# Altium schematic sheet ADC-DMUX.SchDoc: <SPECIFIC SHEET FUNCTION>
size A3; Date: DO NOT USE, RATHER USE PROJ OPTIONS; DrawnBy: DO NOT USE, RATHER USE PROJ OPTIONS; Engineer: DO NOT USE, RATHER USE PROJ OPTIONS; Organization: DO NOT USE, RATHER USE PROJ OPTIONS; DocumentNumber: 2; Revision: DO NOT USE, RATHER USE PROJ OPTIONS; SheetNumber: 6; SheetTotal: 12; SCH_Sheet_Filename: ADC-DMUX.SchDoc; CurrentTime: DO NOT USE, RATHER USE PROJ OPTIONS; Time: DO NOT USE, RATHER USE PROJ OPTIONS; DocumentFullPathAndName: DO NOT USE, RATHER USE PROJ OPTIONS; DocumentName: DO NOT USE, RATHER USE PROJ OPTIONS; ModifiedDate: DO NOT USE, RATHER USE PROJ OPTIONS; ImagePath: DO NOT USE, RATHER USE PROJ OPTIONS
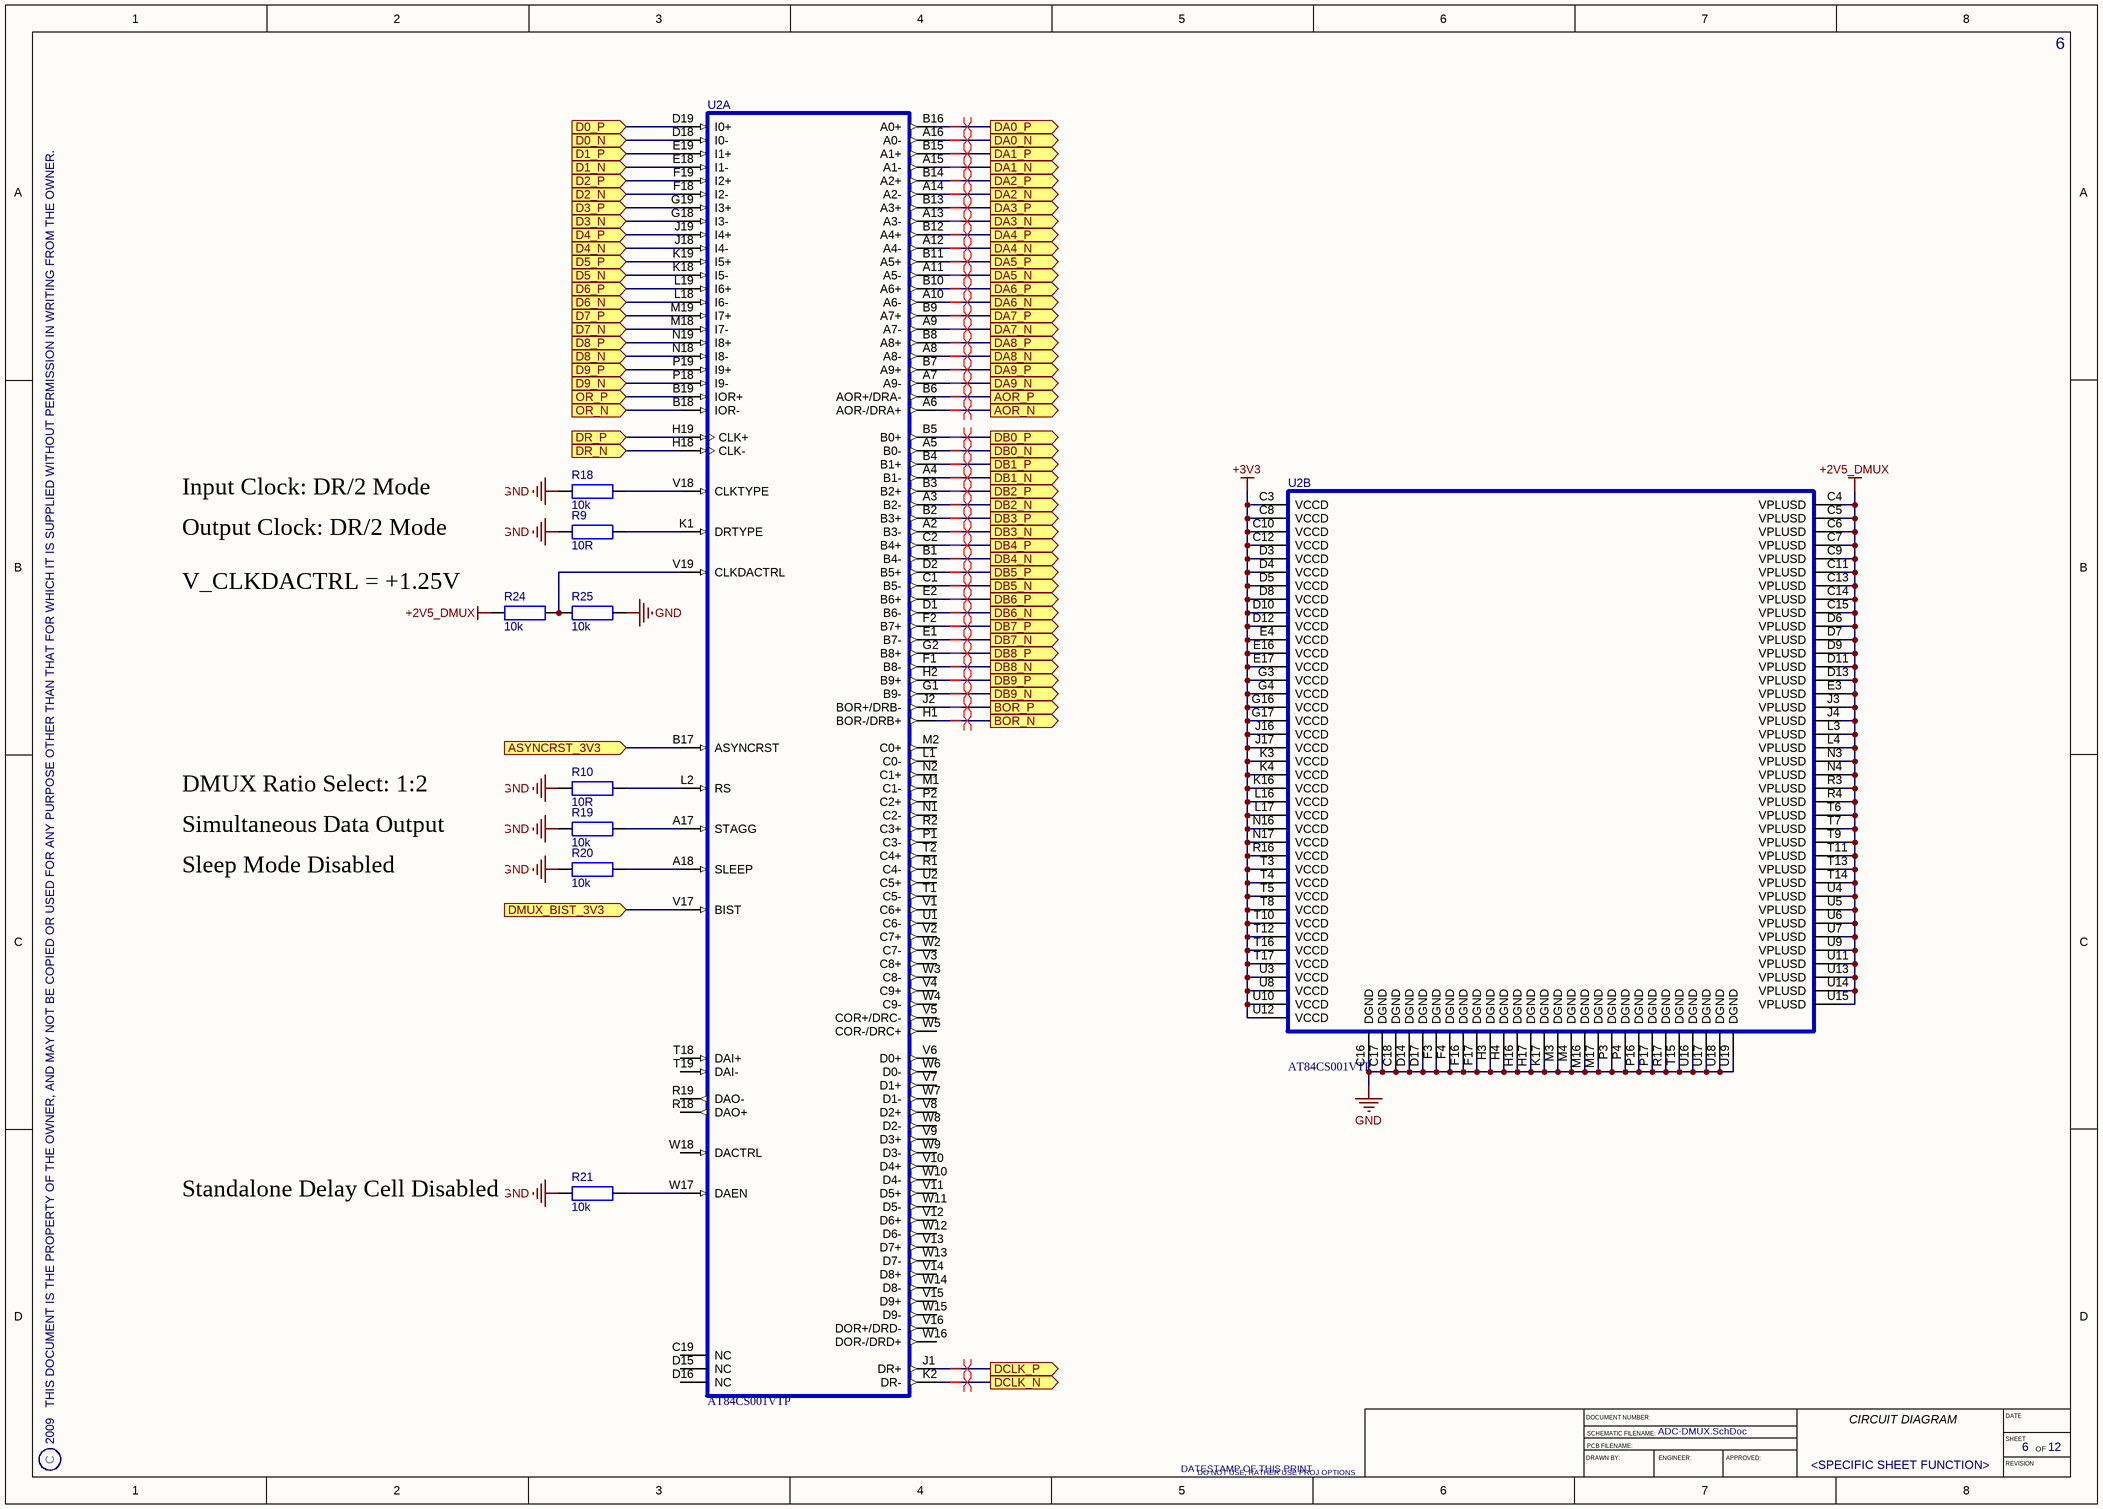
[diagram p0: ADC-DMUX.SchDoc]

## Parts
R9  10R  [0603]
R10  10R  [0603]
R18  10k  [0603]
R19  10k  [0603]
R20  10k  [0603]
R21  10k  [0603]
R24  10k  [0603]
R25  10k  [0603]
U2  AT84CS001VTP  [BGA240x19]  (parts A,B of 2)

## Ports
AOR_N (out), AOR_P (out), ASYNCRST_3V3 (in), BOR_N (out), BOR_P (out), D0_N (in), D0_P (in), D1_N (in), D1_P (in), D2_N (in), D2_P (in), D3_N (in), D3_P (in), D4_N (in), D4_P (in), D5_N (in), D5_P (in), D6_N (in), D6_P (in), D7_N (in), D7_P (in), D8_N (in), D8_P (in), D9_N (in), D9_P (in), DA0_N (out), DA0_P (out), DA1_N (out), DA1_P (out), DA2_N (out), DA2_P (out), DA3_N (out), DA3_P (out), DA4_N (out), DA4_P (out), DA5_N (out), DA5_P (out), DA6_N (out), DA6_P (out), DA7_N (out), DA7_P (out), DA8_N (out), DA8_P (out), DA9_N (out), DA9_P (out), DB0_N (out), DB0_P (out), DB1_N (out), DB1_P (out), DB2_N (out), DB2_P (out), DB3_N (out), DB3_P (out), DB4_N (out), DB4_P (out), DB5_N (out), DB5_P (out), DB6_N (out), DB6_P (out), DB7_N (out), DB7_P (out), DB8_N (out), DB8_P (out), DB9_N (out), DB9_P (out), DCLK_N (out), DCLK_P (out), DMUX_BIST_3V3 (in), DR_N (in), DR_P (in), OR_N (in), OR_P (in)

## Nets
+2V5_DMUX: R24.1 U2.C4(VPLUSD) U2.C5(VPLUSD) U2.C6(VPLUSD) U2.C7(VPLUSD) U2.C9(VPLUSD) U2.C11(VPLUSD) U2.C13(VPLUSD) U2.C14(VPLUSD) U2.C15(VPLUSD) U2.D6(VPLUSD) U2.D7(VPLUSD) U2.D9(VPLUSD) U2.D11(VPLUSD) U2.D13(VPLUSD) U2.E3(VPLUSD) U2.J3(VPLUSD) U2.J4(VPLUSD) U2.L3(VPLUSD) U2.L4(VPLUSD) U2.N3(VPLUSD) U2.N4(VPLUSD) U2.R3(VPLUSD) U2.R4(VPLUSD) U2.T6(VPLUSD) U2.T7(VPLUSD) U2.T9(VPLUSD) U2.T11(VPLUSD) U2.T13(VPLUSD) U2.T14(VPLUSD) U2.U4(VPLUSD) U2.U5(VPLUSD) U2.U6(VPLUSD) U2.U7(VPLUSD) U2.U9(VPLUSD) U2.U11(VPLUSD) U2.U13(VPLUSD) U2.U14(VPLUSD) U2.U15(VPLUSD)
+3V3: U2.C3(VCCD) U2.C8(VCCD) U2.C10(VCCD) U2.C12(VCCD) U2.D3(VCCD) U2.D4(VCCD) U2.D5(VCCD) U2.D8(VCCD) U2.D10(VCCD) U2.D12(VCCD) U2.E4(VCCD) U2.E16(VCCD) U2.E17(VCCD) U2.G3(VCCD) U2.G4(VCCD) U2.G16(VCCD) U2.G17(VCCD) U2.J16(VCCD) U2.J17(VCCD) U2.K3(VCCD) U2.K4(VCCD) U2.K16(VCCD) U2.L16(VCCD) U2.L17(VCCD) U2.N16(VCCD) U2.N17(VCCD) U2.R16(VCCD) U2.T3(VCCD) U2.T4(VCCD) U2.T5(VCCD) U2.T8(VCCD) U2.T10(VCCD) U2.T12(VCCD) U2.T16(VCCD) U2.T17(VCCD) U2.U3(VCCD) U2.U8(VCCD) U2.U10(VCCD) U2.U12(VCCD)
GND: R9.1 R10.1 R18.1 R19.1 R20.1 R21.1 R25.2 U2.C16(DGND) U2.C17(DGND) U2.C18(DGND) U2.D14(DGND) U2.D17(DGND) U2.F3(DGND) U2.F4(DGND) U2.F16(DGND) U2.F17(DGND) U2.H3(DGND) U2.H4(DGND) U2.H16(DGND) U2.H17(DGND) U2.K17(DGND) U2.M3(DGND) U2.M4(DGND) U2.M16(DGND) U2.M17(DGND) U2.P3(DGND) U2.P4(DGND) U2.P16(DGND) U2.P17(DGND) U2.R17(DGND) U2.T15(DGND) U2.U16(DGND) U2.U17(DGND) U2.U18(DGND) U2.U19(DGND)
AOR_N: U2.A6(AOR-/DRA+) ; port AOR_N
AOR_P: U2.B6(AOR+/DRA-) ; port AOR_P
ASYNCRST_3V3: U2.B17(ASYNCRST) ; port ASYNCRST_3V3
BOR_N: U2.H1(BOR-/DRB+) ; port BOR_N
BOR_P: U2.J2(BOR+/DRB-) ; port BOR_P
D0_N: U2.D18(I0-) ; port D0_N
D0_P: U2.D19(I0+) ; port D0_P
D1_N: U2.E18(I1-) ; port D1_N
D1_P: U2.E19(I1+) ; port D1_P
D2_N: U2.F18(I2-) ; port D2_N
D2_P: U2.F19(I2+) ; port D2_P
D3_N: U2.G18(I3-) ; port D3_N
D3_P: U2.G19(I3+) ; port D3_P
D4_N: U2.J18(I4-) ; port D4_N
D4_P: U2.J19(I4+) ; port D4_P
D5_N: U2.K18(I5-) ; port D5_N
D5_P: U2.K19(I5+) ; port D5_P
D6_N: U2.L18(I6-) ; port D6_N
D6_P: U2.L19(I6+) ; port D6_P
D7_N: U2.M18(I7-) ; port D7_N
D7_P: U2.M19(I7+) ; port D7_P
D8_N: U2.N18(I8-) ; port D8_N
D8_P: U2.N19(I8+) ; port D8_P
D9_N: U2.P18(I9-) ; port D9_N
D9_P: U2.P19(I9+) ; port D9_P
DA0_N: U2.A16(A0-) ; port DA0_N
DA0_P: U2.B16(A0+) ; port DA0_P
DA1_N: U2.A15(A1-) ; port DA1_N
DA1_P: U2.B15(A1+) ; port DA1_P
DA2_N: U2.A14(A2-) ; port DA2_N
DA2_P: U2.B14(A2+) ; port DA2_P
DA3_N: U2.A13(A3-) ; port DA3_N
DA3_P: U2.B13(A3+) ; port DA3_P
DA4_N: U2.A12(A4-) ; port DA4_N
DA4_P: U2.B12(A4+) ; port DA4_P
DA5_N: U2.A11(A5-) ; port DA5_N
DA5_P: U2.B11(A5+) ; port DA5_P
DA6_N: U2.A10(A6-) ; port DA6_N
DA6_P: U2.B10(A6+) ; port DA6_P
DA7_N: U2.A9(A7-) ; port DA7_N
DA7_P: U2.B9(A7+) ; port DA7_P
DA8_N: U2.A8(A8-) ; port DA8_N
DA8_P: U2.B8(A8+) ; port DA8_P
DA9_N: U2.A7(A9-) ; port DA9_N
DA9_P: U2.B7(A9+) ; port DA9_P
DB0_N: U2.A5(B0-) ; port DB0_N
DB0_P: U2.B5(B0+) ; port DB0_P
DB1_N: U2.A4(B1-) ; port DB1_N
DB1_P: U2.B4(B1+) ; port DB1_P
DB2_N: U2.A3(B2-) ; port DB2_N
DB2_P: U2.B3(B2+) ; port DB2_P
DB3_N: U2.A2(B3-) ; port DB3_N
DB3_P: U2.B2(B3+) ; port DB3_P
DB4_N: U2.B1(B4-) ; port DB4_N
DB4_P: U2.C2(B4+) ; port DB4_P
DB5_N: U2.C1(B5-) ; port DB5_N
DB5_P: U2.D2(B5+) ; port DB5_P
DB6_N: U2.D1(B6-) ; port DB6_N
DB6_P: U2.E2(B6+) ; port DB6_P
DB7_N: U2.E1(B7-) ; port DB7_N
DB7_P: U2.F2(B7+) ; port DB7_P
DB8_N: U2.F1(B8-) ; port DB8_N
DB8_P: U2.G2(B8+) ; port DB8_P
DB9_N: U2.G1(B9-) ; port DB9_N
DB9_P: U2.H2(B9+) ; port DB9_P
DCLK_N: U2.K2(DR-) ; port DCLK_N
DCLK_P: U2.J1(DR+) ; port DCLK_P
DMUX_BIST_3V3: U2.V17(BIST) ; port DMUX_BIST_3V3
DR_N: U2.H18(CLK-) ; port DR_N
DR_P: U2.H19(CLK+) ; port DR_P
OR_N: U2.B18(IOR-) ; port OR_N
OR_P: U2.B19(IOR+) ; port OR_P
NetR9_2: R9.2 U2.K1(DRTYPE)
NetR10_2: R10.2 U2.L2(RS)
NetR18_2: R18.2 U2.V18(CLKTYPE)
NetR19_2: R19.2 U2.A17(STAGG)
NetR20_2: R20.2 U2.A18(SLEEP)
NetR21_2: R21.2 U2.W17(DAEN)
NetR24_2: R24.2 R25.1 U2.V19(CLKDACTRL)

Not connected (* = marked no-connect by the designer): U2 C19(NC) D15(NC) D16(NC) L1(C0-) M1(C1-) M2(C0+) N1(C2-) N2(C1+) P1(C3-) P2(C2+) R1(C4-) R2(C3+) R18(DAO+) R19(DAO-) T1(C5-) T2(C4+) T18(DAI+) T19(DAI-) U1(C6-) U2(C5+) V1(C6+) V2(C7+) V3(C8+) V4(C9+) V5(COR+/DRC-) V6(D0+) V7(D1+) V8(D2+) V9(D3+) V10(D4+) V11(D5+) V12(D6+) V13(D7+) V14(D8+) V15(D9+) V16(DOR+/DRD-) W2(C7-) W3(C8-) W4(C9-) W5(COR-/DRC+) W6(D0-) W7(D1-) W8(D2-) W9(D3-) W10(D4-) W11(D5-) W12(D6-) W13(D7-) W14(D8-) W15(D9-) W16(DOR-/DRD+) W18(DACTRL)

## Layout directives
differential pair: AOR_N, AOR_P, BOR_N, BOR_P, DA0_N, DA0_P, DA1_N, DA1_P, DA2_N, DA2_P, DA3_N, DA3_P, DA4_N, DA4_P, DA5_N, DA5_P, DA6_N, DA6_P, DA7_N, DA7_P, DA8_N, DA8_P, DA9_N, DA9_P, DB0_N, DB0_P, DB1_N, DB1_P, DB2_N, DB2_P, DB3_N, DB3_P, DB4_N, DB4_P, DB5_N, DB5_P, DB6_N, DB6_P, DB7_N, DB7_P, DB8_N, DB8_P, DB9_N, DB9_P, DCLK_N, DCLK_P

## Notes on the sheet
- Input Clock: DR/2 Mode
- Output Clock: DR/2 Mode
- (near R24) V_CLKDACTRL = +1.25V
- Simultaneous Data Output
- DMUX Ratio Select: 1:2
- Sleep Mode Disabled
- Standalone Delay Cell Disabled
- 2009   THIS DOCUMENT IS THE PROPERTY OF THE OWNER, AND MAY NOT BE COPIED OR USED FOR ANY PURPOSE OTHER THAN THAT FOR WHICH IT IS SUPPLIED WITHOUT PERMISSION IN WRITING FROM THE OWNER.
- C
- DATESTAMP OF THIS PRINT
- DRAWN BY:
- DOCUMENT NUMBER:
- SCHEMATIC FILENAME:
- PCB FILENAME:
- ENGINEER:
- APPROVED:
- CIRCUIT DIAGRAM
- DATE
- SHEET
- REVISION
- OF

## Library data of the parts
R9 R10 R18-R21 R24 R25 = RES-0805: RESISTOR SMD 0603; Checked_By: NN; Manufacturer: *; Manufacturer_PN: *; Created_By: *; Checked_Date: 5-08-2009; HelpURL: *; ComponentLink1Description: Footprint Detail; ComponentLink1URL: *; ComponentLink2Description: Application Note; ComponentLink2URL: *; ComponentLink3Description: Layout Guidelines; ComponentLink3URL: *; ComponentLink4Description: Technology Reference; ComponentLink4URL: *; Supplier1: *; Supplier2: *; Unit_Cost: *; MOQ: *; Leadtime: *; Inventory_Stock: *; Tolerance: *; Wattage: *; Voltage: *; Package: 0603; ComponentLink5Description: Production Detail; ComponentLink5URL: *; Note: *; Stock Code: *
  R9 R10: Value: 10R
  R18-R21 R24 R25: Value: 10k
U2 = AT84CS001VTP: 10-bit 2.2Gsps 1:4 DMUX; Manufacturer: e2V; Created_By: IN; Manufacturer_PN: AT84CS001VTP; Checked_By: *; Checked_Date: *; HelpURL: X:\Datasheets\By_Manufacturer\National Semi\ADC08D1520.pdf; ComponentLink1Description: X:\Datasheets\By_Manufacturer\National Semi\ADC08D1520.pdf#page=4; ComponentLink1URL: *; ComponentLink2Description: Application Note; ComponentLink2URL: *; ComponentLink3Description: Layout Guidelines; ComponentLink3URL: *; ComponentLink4Description: Technology Reference; ComponentLink4URL: *; Supplier1: *; Supplier2: *; Unit_Cost: *; MOQ: *; Leadtime: *; Inventory_Stock: *; Tolerance: *; Wattage: *; Voltage: *; Package: *; ComponentLink5Description: Production Detail; ComponentLink5URL: *; Note: *; Stock Code: *